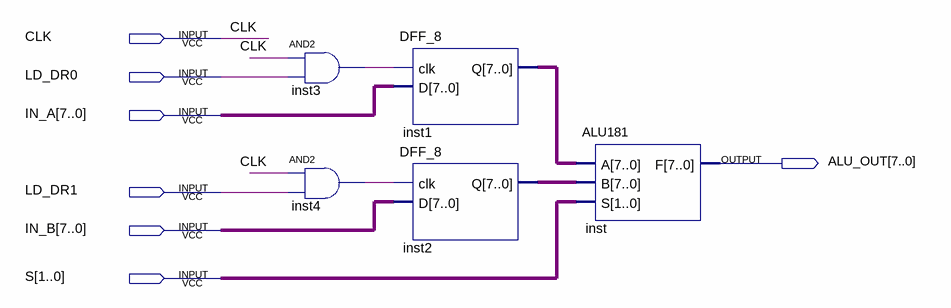
[diagram p0: schematic sheet]
// Quartus schematic ALU.bdf as structural Verilog: 5 symbols, 7 pins
module ALU (
  input  CLK,
  input  LD_DR0,
  input  [7:0] IN_A,
  input  LD_DR1,
  input  [7:0] IN_B,
  input  [1:0] S,
  output [7:0] ALU_OUT
);

  wire inst3_out, inst4_out;
  wire [7:0] inst1_q, inst2_q;

  and inst3 (inst3_out, CLK, LD_DR0);
  and inst4 (inst4_out, CLK, LD_DR1);
  DFF_8 inst1 (.clk(inst3_out), .D(IN_A), .Q(inst1_q));
  DFF_8 inst2 (.clk(inst4_out), .D(IN_B), .Q(inst2_q));
  ALU181 inst (.A(inst1_q), .B(inst2_q), .S(S), .F(ALU_OUT));
endmodule
